# Altium schematic sheet Battery Management.SchDoc
size A4
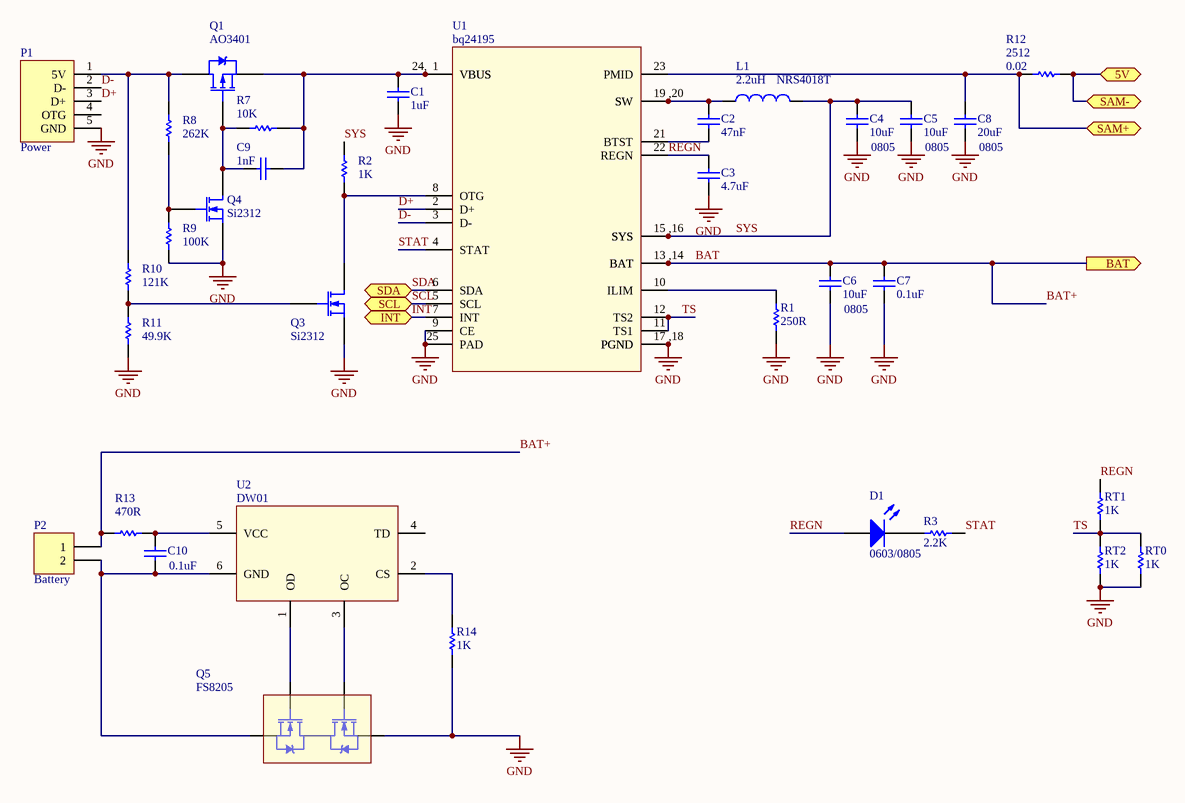
[diagram p0: Battery Management.SchDoc]

## Parts
C1  value 1uF  [D0805]  (hidden comment: 0603)
C2  value 47nF  [D0805]  (hidden comment: 0603)
C3  value 4.7uF  [D0603]  (hidden comment: 0603)
C4  0805  value 10uF  [D0805]
C5  0805  value 10uF  [D0805]
C6  0805  value 10uF  [D0805]
C7  value 0.1uF  [D0603]  (hidden comment: 0603)
C8  0805  value 20uF  [D0805]
C9  value 1nF  [D0603]  (hidden comment: 0603)
C10  value 0.1uF  [D0603]  (hidden comment: 0603)
D1  0603/0805  [D0805_Diode]
L1  value 2.2uH  CommentType: NRS4018T  [INDUCTOR.4040]  (hidden comment: Inductor)
P1  Power  [Micro.Horn]
P2  Battery  [BAT_RECT]
Q1  AO3401  [SOT23]
Q3  Si2312  [SOT23]
Q4  Si2312  [SOT23]
Q5  FS8205  [SOT23-6_N]
R1  value 250R  [D0603]  (hidden comment: 0603)
R2  value 1K  [D0603]  (hidden comment: 0603)
R3  value 2.2K  [D0603]  (hidden comment: 0603)
R7  value 10K  [D0603]  (hidden comment: 0603)
R8  value 262K  [D0603]  (hidden comment: 0603)
R9  value 100K  [D0603]  (hidden comment: 0603)
R10  value 121K  [D0603]  (hidden comment: 0603)
R11  value 49.9K  [D0603]  (hidden comment: 0603)
R12  2512  value 0.02  [D1206]
R13  value 470R  [D0603]  (hidden comment: 0603)
R14  value 1K  [D0603]  (hidden comment: 0603)
RT0  value 1K  [D0603]  (hidden comment: 0603)
RT1  value 1K  [D0603]  (hidden comment: 0603)
RT2  value 1K  [D0603]  (hidden comment: 0603)
U1  bq24195  [QFN24]
U2  DW01  [SOT23-6_N]

## Ports
5V, BAT (out), INT, SAM+, SAM-, SCL, SDA

## Nets
GND: C1.1 C3.1 C4.1 C5.1 C6.1 C7.1 C8.1 P1.5(GND) Q3.3(S) Q4.3(S) Q5.3(S2) R1.1 R9.1 R11.1 R14.1 RT0.1 RT2.1 U1.9(CE) U1.17(PGND) U1.18(PGND) U1.25(PAD)
5V: R12.1 ; port 5V, port SAM-
BAT: C6.2 C7.2 P2.1 R13.1 U1.13(BAT) U1.14(BAT) ; port BAT  [also labelled BAT+]
D+: P1.3(D+) U1.2(D+)
D-: P1.2(D-) U1.3(D-)
INT: U1.7(INT) ; port INT
REGN: C3.2 D1.1(A) RT1.2 U1.22(REGN)
SAM+: C8.2 R12.2 U1.23(PMID) ; port SAM+
SCL: U1.5(SCL) ; port SCL
SDA: U1.6(SDA) ; port SDA
STAT: R3.1 U1.4(STAT)
SYS: C4.2 C5.2 L1.2 R2.2 U1.15(SYS) U1.16(SYS)
TS: RT0.2 RT1.1 RT2.2 U1.11(TS1) U1.12(TS2)
NetC1_2: C1.2 C9.1 Q1.3(S) R7.1 U1.1(VBUS) U1.24(VBUS)
NetC2_1: C2.1 U1.21(BTST)
NetC2_2: C2.2 L1.1 U1.19(SW) U1.20(SW)
NetC9_2: C9.2 Q1.1(G) Q4.2(D) R7.2
NetC10_1: C10.1 P2.2 Q5.1(S1) U2.6(GND)
NetC10_2: C10.2 R13.2 U2.5(VCC)
NetD1_2: D1.2(K) R3.2
NetP1_1: P1.1(5V) Q1.2(D) R8.2 R10.2
NetQ3_1: Q3.1(G) R10.1 R11.2
NetQ3_2: Q3.2(D) R2.1 U1.8(OTG)
NetQ4_1: Q4.1(G) R8.1 R9.2
NetQ5_4: Q5.4(G2) U2.3(OC)
NetQ5_6: Q5.6(G1) U2.1(OD)
NetR1_2: R1.2 U1.10(ILIM)
NetR14_2: R14.2 U2.2(CS)

Not connected (* = marked no-connect by the designer): P1 4(OTG); Q5 2(D12) 5(D12); U2 4(TD)

## Notes on the sheet
- (in symbol bq24195) 24,; ,20; ,16; ,14; ,18

## Library data of the parts
C1-C10 = Cap: Capacitor; Published: 8-Jun-2000; LatestRevisionDate: 17-Jul-2002; LatestRevisionNote: Re-released for DXP Platform.; PackageReference: RAD-0.3; Publisher: Altium Limited; PackageDescription: Radial Cap, Thru-Hole; 2 Leads; 0.3 in Pin Spacing
D1 = LED0: Typical INFRARED GaAs LED; Published: 8-Jun-2000; LatestRevisionDate: 08-Jul-2005; LatestRevisionNote: Mech Layer 1 removed.; PackageReference: LED-0; Publisher: Altium Limited; PackageDescription: LED; 2 Leads
L1 = Inductor: Code_IEC: 1005; Published: 8-Jun-2000; LatestRevisionDate: 29-May-2009; LatestRevisionNote: IPC-7351 Footprint Added.; PackageReference: 0402-A; Publisher: Altium Limited; PackageDescription: Chip Inductor; Code_JEITA: 0402
P1 = Micro USB Horn: MIcro USB Connector Horn
P2 = Header 2: Header, 2-Pin; LatestRevisionDate: 17-Jul-2002; LatestRevisionNote: Re-released for DXP Platform.; Publisher: Altium Limited
Q1 = AO3401: AO3401 P-Channel MOSFET
Q3 Q4 = Si2312: SI2312 N-Channel MOSFEt
Q5 = FS8205: FS8205 Dual MOS
R1-R3 R7-R14 RT0-RT2 = Res1: Resistor; Published: 8-Jun-2000; LatestRevisionDate: 17-Jul-2002; LatestRevisionNote: Re-released for DXP Platform.; PackageReference: AXIAL-0.3; Publisher: Altium Limited; PackageDescription: Axial Device, Thru-Hole; 2 Leads; 0.3 in Pin Spacing
U1 = bq24195: A Battery charger manager published by Ti
U2 = DW01: Battery Protector